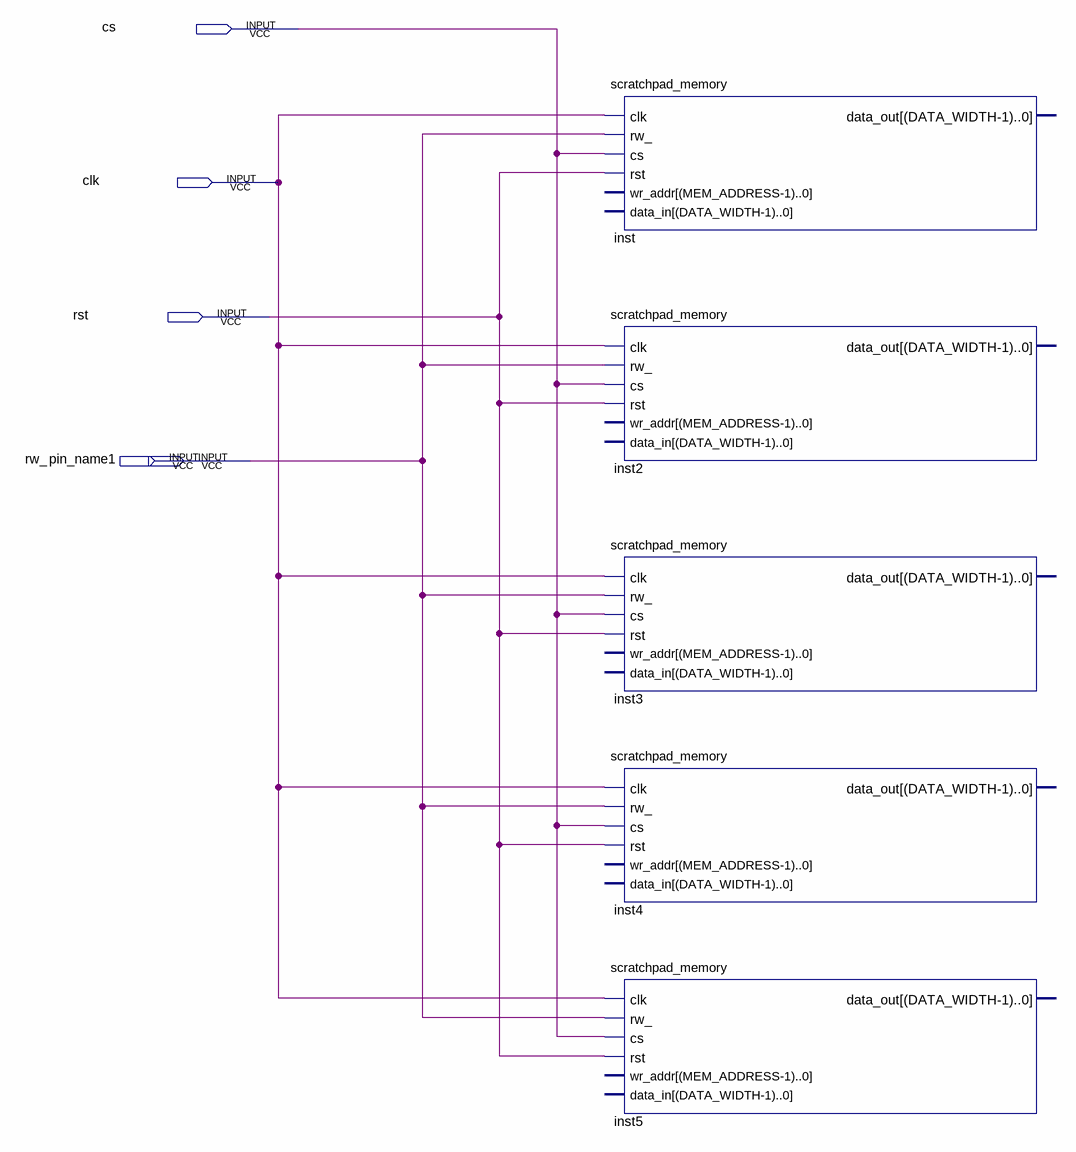
[diagram p0: schematic sheet]
// Quartus schematic memory_bank.bdf as structural Verilog: 5 symbols, 5 pins
module memory_bank (
  input  cs,
  input  clk,
  input  rst,
  input  rw_,
  input  pin_name1
);

  scratchpad_memory inst (.clk(clk), .rw_(pin_name1), .cs(cs), .rst(rst));  // open: wr_addr, data_in, data_out
  scratchpad_memory inst2 (.clk(clk), .rw_(pin_name1), .cs(cs), .rst(rst));  // open: wr_addr, data_in, data_out
  scratchpad_memory inst3 (.clk(clk), .rw_(pin_name1), .cs(cs), .rst(rst));  // open: wr_addr, data_in, data_out
  scratchpad_memory inst4 (.clk(clk), .rw_(pin_name1), .cs(cs), .rst(rst));  // open: wr_addr, data_in, data_out
  scratchpad_memory inst5 (.clk(clk), .rw_(pin_name1), .cs(cs), .rst(rst));  // open: wr_addr, data_in, data_out
endmodule
